# Altium schematic sheet [01] - SiPM Carrier.SchDoc
size A4; Address1: III. Physikalisches Institut B; Address2: RWTH Aachen University; Address3: Otto-Blumenthal-Strasse; Address4: 52074 Aachen, GERMANY; DocumentNumber: 0; SheetNumber: 0; SheetTotal: 99
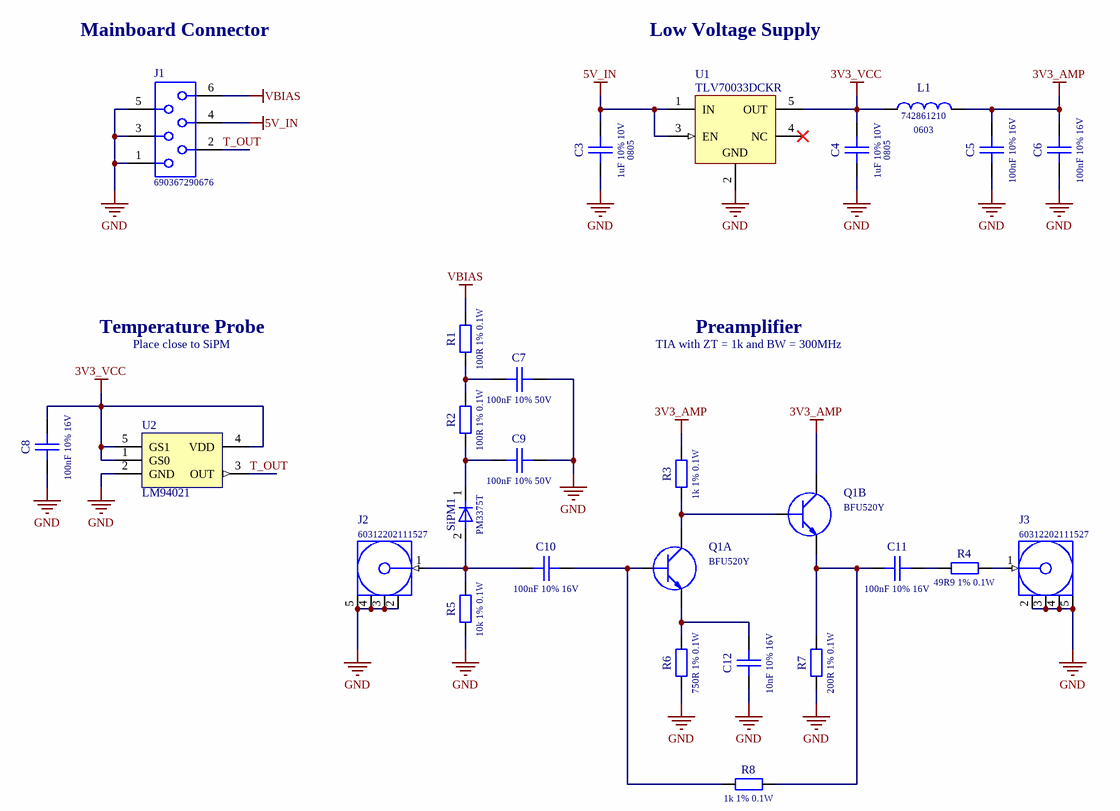
[diagram p0: [01] - SiPM Carrier.SchDoc]

## Parts
C3  PackageReference: 0805  [0805_CAP]  (hidden comment: 1uF 10% 10V)
C4  PackageReference: 0805  [0805_CAP]  (hidden comment: 1uF 10% 10V)
C5  100nF 10% 16V  [0603_CAP]
C6  100nF 10% 16V  [0603_CAP]
C7  100nF 10% 50V  [0603_CAP]
C8  100nF 10% 16V  [0603_CAP]
C9  100nF 10% 50V  [0603_CAP]
C10  100nF 10% 16V  [0603_CAP]
C11  100nF 10% 16V  [0603_CAP]
C12  10nF 10% 16V  [0603_CAP]
J1  690367290676  [690367290676]
J2  60312202111527  [60312202111527]
J3  60312202111527  [60312202111527]
L1  PackageReference: 0603  [0603_RES]  (hidden comment: 742861210)
Q1  BFU520Y  [SOT363-6]  (parts A,B of 2)
R1  100R 1% 0.1W  [0603_RES]
R2  100R 1% 0.1W  [0603_RES]
R3  1k 1% 0.1W  [0603_RES]
R4  49R9 1% 0.1W  [0603_RES]
R5  10k 1% 0.1W  [0603_RES]
R6  750R 1% 0.1W  [0603_RES]
R7  200R 1% 0.1W  [0603_RES]
R8  1k 1% 0.1W  [0603_RES]
SiPM1  PM3375T  [PM3375T_SMD]
U1  TLV70033DCKR  [TI-DCK5_V]
U2  LM94021  [SC70]

## Nets
3V3_AMP: C5.2 C6.2 L1.2 Q1.3(C) R3.1
3V3_VCC: C4.2 C8.2 L1.1 U1.5(OUT) U2.1(GS0) U2.4(VDD) U2.5(GS1)
5V_IN: C3.2 J1.4 U1.1(IN) U1.3(EN)
GND: C3.1 C4.1 C5.1 C6.1 C7.2 C8.1 C9.2 C12.1 J1.1 J1.3 J1.5 J2.2(GND) J2.3(GND) J2.4(GND) J2.5(GND) J3.2(GND) J3.3(GND) J3.4(GND) J3.5(GND) R5.2 R6.2 R7.2 U1.2(GND) U2.2(GND)
VBIAS: J1.6 R1.1
T_OUT: J1.2 U2.3(OUT)
NetC7_1: C7.1 R1.2 R2.1
NetC9_1: C9.1 R2.2 SiPM1.1(C)
NetC10_1: C10.1 J2.1(Signal) R5.1 SiPM1.2(A)
NetC10_2: C10.2 Q1.1(B) R8.2
NetC11_1: C11.1 Q1.5(E) R7.1 R8.1
NetC11_2: C11.2 R4.2
NetC12_2: C12.2 Q1.2(E) R6.1
NetJ3_1: J3.1(Signal) R4.1
NetQ1_4: Q1.4(B) Q1.6(C) R3.2

Not connected (* = marked no-connect by the designer): U1 4(NC)*

## Notes on the sheet
- Mainboard Connector
- Low Voltage Supply
- Temperature Probe
- Place close to SiPM
- Preamplifier
- TIA with ZT = 1k and BW = 300MHz
- TITLE
- REVISION
- PROJECT
- AUTHOR
- DESC.
- DATE
- SHEET
- OF

## Library data of the parts
C3-C12 = Capacitor: Simple generic capacitor.
  C3 C4: Value: 1uF 10% 10V
  C5 C6 C8 C10 C11: PackageReference: 0603; Value: 100nF 10% 16V
  C7 C9: PackageReference: 0603; Value: 100nF 10% 50V
  C12: PackageReference: 0603; Value: 10nF 10% 16V
J1 = 690367290676: WR-MM MiniModule Connector, Female, SMT, Vertical, pitch 2.54mm, 6pins; Pin Number: 6; Insulation Resistance: >1000MOhm; Rated Current: 1.5A; Working Voltage: 100VAC; Withstanding Voltage: 500VAC; Contact Resistance: 10mOhm; ComponentLink1Description: Manufacturer; ComponentLink1URL: http://www.we-online.de; ComponentLink2Description: Datasheet; ComponentLink2URL: https://katalog.we-online.de/em/datasheet/690367290676.pdf; Part Number: 690367290676; Published Date: June 2019; Publisher: Wurth Elektronik; Pitch: 2.54mm; Operating Temperature: -40 to +105degC; Mounting Technology: SMT; Packaging: Tape and Reel; Gender: Female; Orientation: Vertical
J2 J3 = 60312202111527: WR-SMA PCB End Launch Jack Round Post for 1.6mm PCB, SMT, Straight; Impedance: 50Ohm; Connector Type: SMA; Frequency Range: DC~18GHz; Interface: MIL-STD-348; Center Contact Diameter: 0.76mm; ComponentLink1Description: Manufacturer; ComponentLink1URL: http://www.we-online.de; ComponentLink2Description: Datasheet; ComponentLink2URL: https://katalog.we-online.com/em/datasheet/60312202111527.pdf; Part Number: 60312202111527; Published Date: May 2019; Publisher: Wurth Elektronik; Operating Temperature: -65 to +165degC; Gender: Jack; Packaging: Tray; Mounting Technology: SMT; Orientation Type: Straight
L1 = Inductor: Simple generic inductor.; PartNumber: XXX; Value: 742861210
Q1 = BFU520Y: Dual NPN wideband silicon RF transistor.; PackageReference: SOT363-6; Value: BFU520Y
R1-R8 = Resistor: Simple generic resistor.; PackageReference: 0603
  R1 R2: Value: 100R 1% 0.1W
  R3 R8: Value: 1k 1% 0.1W
  R4: Value: 49R9 1% 0.1W
  R5: Value: 10k 1% 0.1W
  R6: Value: 750R 1% 0.1W
  R7: Value: 200R 1% 0.1W
SiPM1 = PM3375T: Silicon Photomultiplier, 3x3mm2 - 75um type - trench - SMD housing; Value: PM3375T
U1 = TLV70033DCKR: Single Output LDO, 200 mA, Fixed 3.3 V Output, 2 to 5.5 V Input, with Low IQ, 5-pin SC70 (DCK), -40 to 125 degC, Green (RoHS & no Sb/Br); Manufacturer: Texas Instruments; Accuracy(%): 2; Fixed Output Options(V): 3.3; Iout(Max)(A): 0.2; Iq(Typ)(mA): 0.03; SubFamily: Single Channel LDO; Vdo(Typ)(mV): 175; Vin(Max)(V): 5.5; DatasheetVersion: SLVSA00D; PackageVersion: 4093553-3/G; PackageReference: DCK5; PackageDescription: 5-Pin Plastic Small-Outline, Body 2 x 1.25 mm, Pitch 0.65 mm; Supplier 1: Digi-Key; Supplier Part Number 1: 296-32413-2-ND; Supplier 2: Digi-Key; Supplier Part Number 2: 296-32413-1-ND; Supplier 3: Digi-Key; Supplier Part Number 3: 296-32413-6-ND; Supplier 4: Newark; Supplier Part Number 4: 55R7467; Supplier 5: Mouser; Supplier Part Number 5: 595-TLV70033DCKR; Eco-Plan: Green (RoHS & no Sb/Br); Vin(Min)(V): 2; Vout Adj(Max)(V): 3.3; Vout Adj(Min)(V): 3.3; Mounting Technology: Surface Mount; Code_JEDEC: MO-203; PartNumber: TLV70033DCKR; ComponentLink1Description: Manufacturer URL; ComponentLink1URL: http://www.ti.com/; ComponentLink2Description: Datasheet; ComponentLink2URL: http://www.ti.com/general/docs/lit/getliterature.tsp?genericPartNumber=TLV70033&fileType=pdf; ComponentLink3Description: Package Specification; ComponentLink3URL: http://www.ti.com/litv/pdf/mpds025f
U2 = LM94021: Multi-Gain Analog Temperature Sensor.; Manufacturer: Texas Instruments; PartNumber: LM94021BIMG; PackageReference: SC70; Value: LM94021